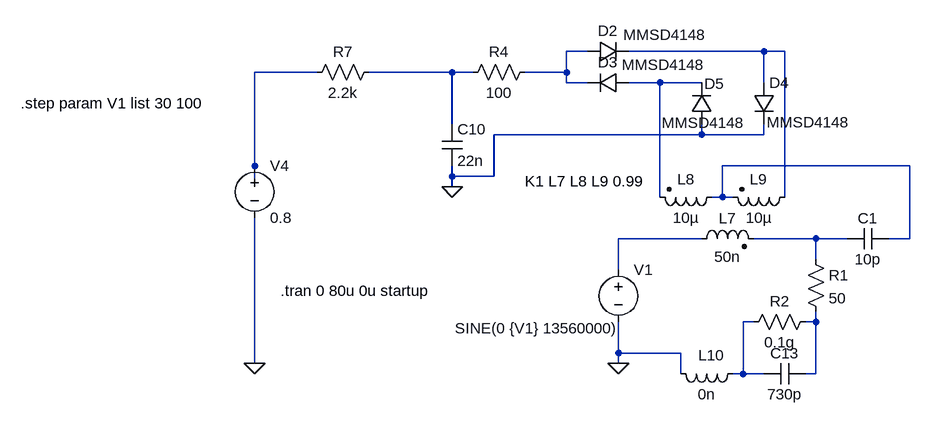
[diagram p0: schematic rf4.asc]
rf4.asc, the LTspice schematic file:
Version 4
SHEET 1 1636 680
WIRE 880 -192 848 -192
WIRE 1152 -192 944 -192
WIRE 1184 -192 1152 -192
WIRE 464 -160 368 -160
WIRE 672 -160 544 -160
WIRE 704 -160 672 -160
WIRE 848 -160 848 -192
WIRE 848 -160 784 -160
WIRE 848 -144 848 -160
WIRE 880 -144 848 -144
WIRE 992 -144 944 -144
WIRE 1056 -144 992 -144
WIRE 1152 -144 1152 -192
WIRE 672 -80 672 -160
WIRE 1056 -64 1056 -80
WIRE 1056 -64 736 -64
WIRE 1152 -64 1152 -80
WIRE 1152 -64 1056 -64
WIRE 368 -16 368 -160
WIRE 1376 -16 1088 -16
WIRE 672 0 672 -16
WIRE 736 0 736 -64
WIRE 736 0 672 0
WIRE 368 16 368 -16
WIRE 672 16 672 0
WIRE 992 32 992 -144
WIRE 1088 32 1088 -16
WIRE 1088 32 1072 32
WIRE 1104 32 1088 32
WIRE 1184 32 1184 -192
WIRE 1056 96 928 96
WIRE 1232 96 1136 96
WIRE 1280 96 1232 96
WIRE 1376 96 1376 -16
WIRE 1376 96 1344 96
WIRE 1232 128 1232 96
WIRE 928 144 928 96
WIRE 1136 224 1120 224
WIRE 1232 224 1232 208
WIRE 1232 224 1216 224
WIRE 928 272 928 224
WIRE 1024 272 928 272
WIRE 368 288 368 64
WIRE 928 288 928 272
WIRE 1024 304 1024 272
WIRE 1120 304 1120 224
WIRE 1120 304 1104 304
WIRE 1152 304 1120 304
WIRE 1232 304 1232 224
WIRE 1232 304 1216 304
FLAG 672 16 0
FLAG 368 288 0
FLAG 928 288 0
SYMBOL res 1216 112 R0
SYMATTR InstName R1
SYMATTR Value 50
SYMBOL ind2 1040 112 R270
WINDOW 0 32 56 VTop 2
WINDOW 3 4 56 VBottom 2
SYMATTR InstName L7
SYMATTR Value 50n
SYMATTR Type ind
SYMBOL ind2 1088 16 R90
WINDOW 0 4 56 VBottom 2
WINDOW 3 32 56 VTop 2
SYMATTR InstName L8
SYMATTR Value 10µ
SYMATTR Type ind
SYMBOL ind2 1200 16 R90
WINDOW 0 4 56 VBottom 2
WINDOW 3 32 56 VTop 2
SYMATTR InstName L9
SYMATTR Value 10µ
SYMATTR Type ind
SYMBOL diode 880 -176 R270
WINDOW 0 32 32 VTop 2
WINDOW 3 57 119 VBottom 2
SYMATTR InstName D2
SYMATTR Value MMSD4148
SYMBOL diode 944 -160 R90
WINDOW 0 0 32 VBottom 2
WINDOW 3 -27 -53 VTop 2
SYMATTR InstName D3
SYMATTR Value MMSD4148
SYMBOL diode 1136 -144 R0
WINDOW 3 20 61 Left 2
SYMATTR Value MMSD4148
SYMATTR InstName D4
SYMBOL diode 1072 -80 R180
WINDOW 0 -19 62 Left 2
WINDOW 3 -50 2 Left 2
SYMATTR InstName D5
SYMATTR Value MMSD4148
SYMBOL cap 656 -80 R0
SYMATTR InstName C10
SYMATTR Value 22n
SYMBOL res 800 -176 R90
WINDOW 0 0 56 VBottom 2
WINDOW 3 32 56 VTop 2
SYMATTR InstName R4
SYMATTR Value 100
SYMBOL cap 1216 288 R90
WINDOW 0 0 32 VBottom 2
WINDOW 3 32 32 VTop 2
SYMATTR InstName C13
SYMATTR Value 730p
SYMBOL ind 1120 288 R90
WINDOW 0 3 49 VBottom 2
WINDOW 3 32 56 VTop 2
SYMATTR InstName L10
SYMATTR Value 0n
SYMBOL voltage 368 -32 R0
WINDOW 123 0 0 Left 2
WINDOW 39 0 0 Left 2
SYMATTR InstName V4
SYMATTR Value 0.8
SYMBOL res 560 -176 R90
WINDOW 0 0 56 VBottom 2
WINDOW 3 32 56 VTop 2
SYMATTR InstName R7
SYMATTR Value 2.2k
SYMBOL voltage 928 128 R0
WINDOW 123 0 0 Left 2
WINDOW 39 0 0 Left 2
WINDOW 3 -252 106 Left 2
SYMATTR Value SINE(0 {V1} 13560000)
SYMATTR InstName V1
SYMBOL res 1120 240 R270
WINDOW 0 32 56 VTop 2
WINDOW 3 0 56 VBottom 2
SYMATTR InstName R2
SYMATTR Value 0.1g
SYMBOL cap 1344 80 R90
WINDOW 0 0 32 VBottom 2
WINDOW 3 32 32 VTop 2
SYMATTR InstName C1
SYMATTR Value 10p
TEXT 408 176 Left 2 !.tran 0 80u 0u startup
TEXT 784 8 Left 2 !K1 L7 L8 L9 0.99
TEXT 8 -112 Left 2 !.step param V1 list 30 100

The netlist it stands for:
* rf4.asc
R1 N008 N010 50
L7 N007 N008 50n
L8 N006 N005 10µ
L9 N002 N006 10µ
D2 N001 N002 MMSD4148
D3 N005 N001 MMSD4148
D4 N002 0 MMSD4148
D5 0 N005 MMSD4148
C10 N004 0 22n
R4 N001 N004 100
C13 N010 N009 730p
L10 N009 0 0n
V4 N003 0 0.8
R7 N004 N003 2.2k
V1 N007 0 SINE(0 {V1} 13560000)
R2 N009 N010 0.1g
C1 N006 N008 10p
.model D D
.lib standard.dio
.tran 0 80u 0u startup
K1 L7 L8 L9 0.99
.step param V1 list 30 100
.backanno
.end